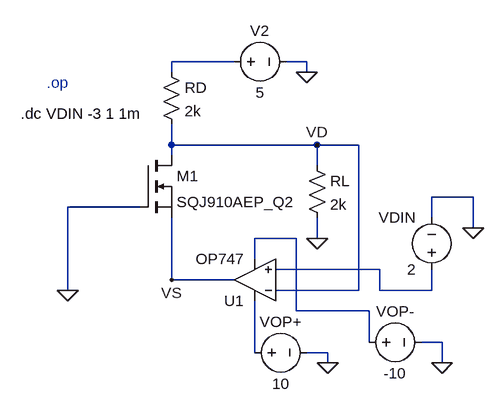
[diagram p0: schematic mos_cg_vds.asc]
mos_cg_vds.asc, the LTspice schematic file:
Version 4.1
SHEET 1 880 680
WIRE 320 -48 224 -48
WIRE 432 -48 400 -48
WIRE 224 -32 224 -48
WIRE 432 -32 432 -48
WIRE 224 80 224 48
WIRE 448 80 224 80
WIRE 512 80 448 80
WIRE 224 96 224 80
WIRE 448 112 448 80
WIRE 688 160 624 160
WIRE 176 176 64 176
WIRE 624 192 624 160
WIRE 688 208 688 160
WIRE 416 224 352 224
WIRE 448 224 448 192
WIRE 352 256 352 224
WIRE 544 272 384 272
WIRE 224 288 224 192
WIRE 320 288 224 288
WIRE 64 304 64 176
WIRE 512 304 512 80
WIRE 512 304 384 304
WIRE 544 304 544 272
WIRE 624 304 624 272
WIRE 624 304 544 304
WIRE 416 336 416 224
WIRE 528 336 416 336
WIRE 528 384 528 336
WIRE 640 384 608 384
WIRE 352 400 352 320
WIRE 464 400 432 400
WIRE 464 416 464 400
WIRE 640 416 640 384
FLAG 448 224 0
FLAG 432 -32 0
FLAG 448 80 VD
FLAG 64 304 0
FLAG 464 416 0
FLAG 640 416 0
FLAG 688 208 0
FLAG 224 288 VS
SYMBOL nmos 176 96 R0
SYMATTR InstName M1
SYMATTR Value SQJ910AEP_Q2
SYMBOL res 208 -48 R0
SYMATTR InstName RD
SYMATTR Value 2k
SYMBOL res 432 96 R0
SYMATTR InstName RL
SYMATTR Value 2k
SYMBOL voltage 304 -48 R270
WINDOW 0 32 56 VTop 2
WINDOW 3 -32 56 VBottom 2
WINDOW 123 0 0 Left 0
WINDOW 39 0 0 Left 0
SYMATTR InstName V2
SYMATTR Value 5
SYMBOL OpAmps\\OP747 352 352 R180
SYMATTR InstName U1
SYMBOL voltage 336 400 R270
WINDOW 0 32 56 VTop 2
WINDOW 3 -32 56 VBottom 2
WINDOW 123 0 0 Left 0
WINDOW 39 0 0 Left 0
SYMATTR InstName VOP+
SYMATTR Value 10
SYMBOL voltage 512 384 R270
WINDOW 0 32 56 VTop 2
WINDOW 3 -32 56 VBottom 2
WINDOW 123 0 0 Left 0
WINDOW 39 0 0 Left 0
SYMATTR InstName VOP-
SYMATTR Value -10
SYMBOL voltage 624 288 R180
WINDOW 0 24 96 Left 2
WINDOW 3 24 16 Left 2
WINDOW 123 0 0 Left 0
WINDOW 39 0 0 Left 0
SYMATTR InstName VDIN
SYMATTR Value 2
TEXT 32 -16 Left 2 ;.op
TEXT -8 32 Left 2 !.dc VDIN -3 1 1m

The netlist it stands for:
* mos_cg_vds.asc
M1 VD 0 VS VS SQJ910AEP_Q2
RD N001 VD 2k
RL VD 0 2k
V2 N001 0 5
X§U1 N003 VD N004 N002 VS OP747  ; pins In+ In- V+ V- OUT
VOP+ N004 0 10
VOP- N002 0 -10
VDIN N003 0 2
.model NMOS NMOS
.model PMOS PMOS
.lib standard.mos
* .op
.dc VDIN -3 1 1m
.backanno
.end

* Results of the author's LTspice run, read from the files saved beside the schematic
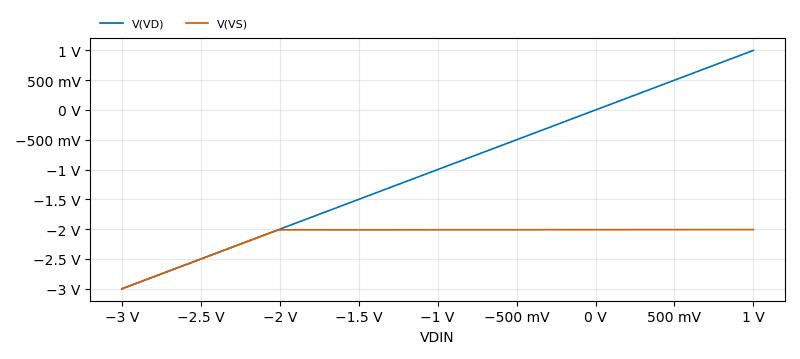
[diagram p1: DC transfer characteristic of mos_cg_vds.asc, plotted from the saved traces]
* DC transfer characteristic, 1 run:
*   V(VD): -3 V at VDIN=-3 V, 1 V at VDIN=1 V, min -3 V, max 1 V
*   V(VS): -3 V at VDIN=-3 V, -2.007 V at VDIN=1 V, min -3 V, max -2.007 V